# EAGLE design BUZZI-46 (EAGLE 5.01)
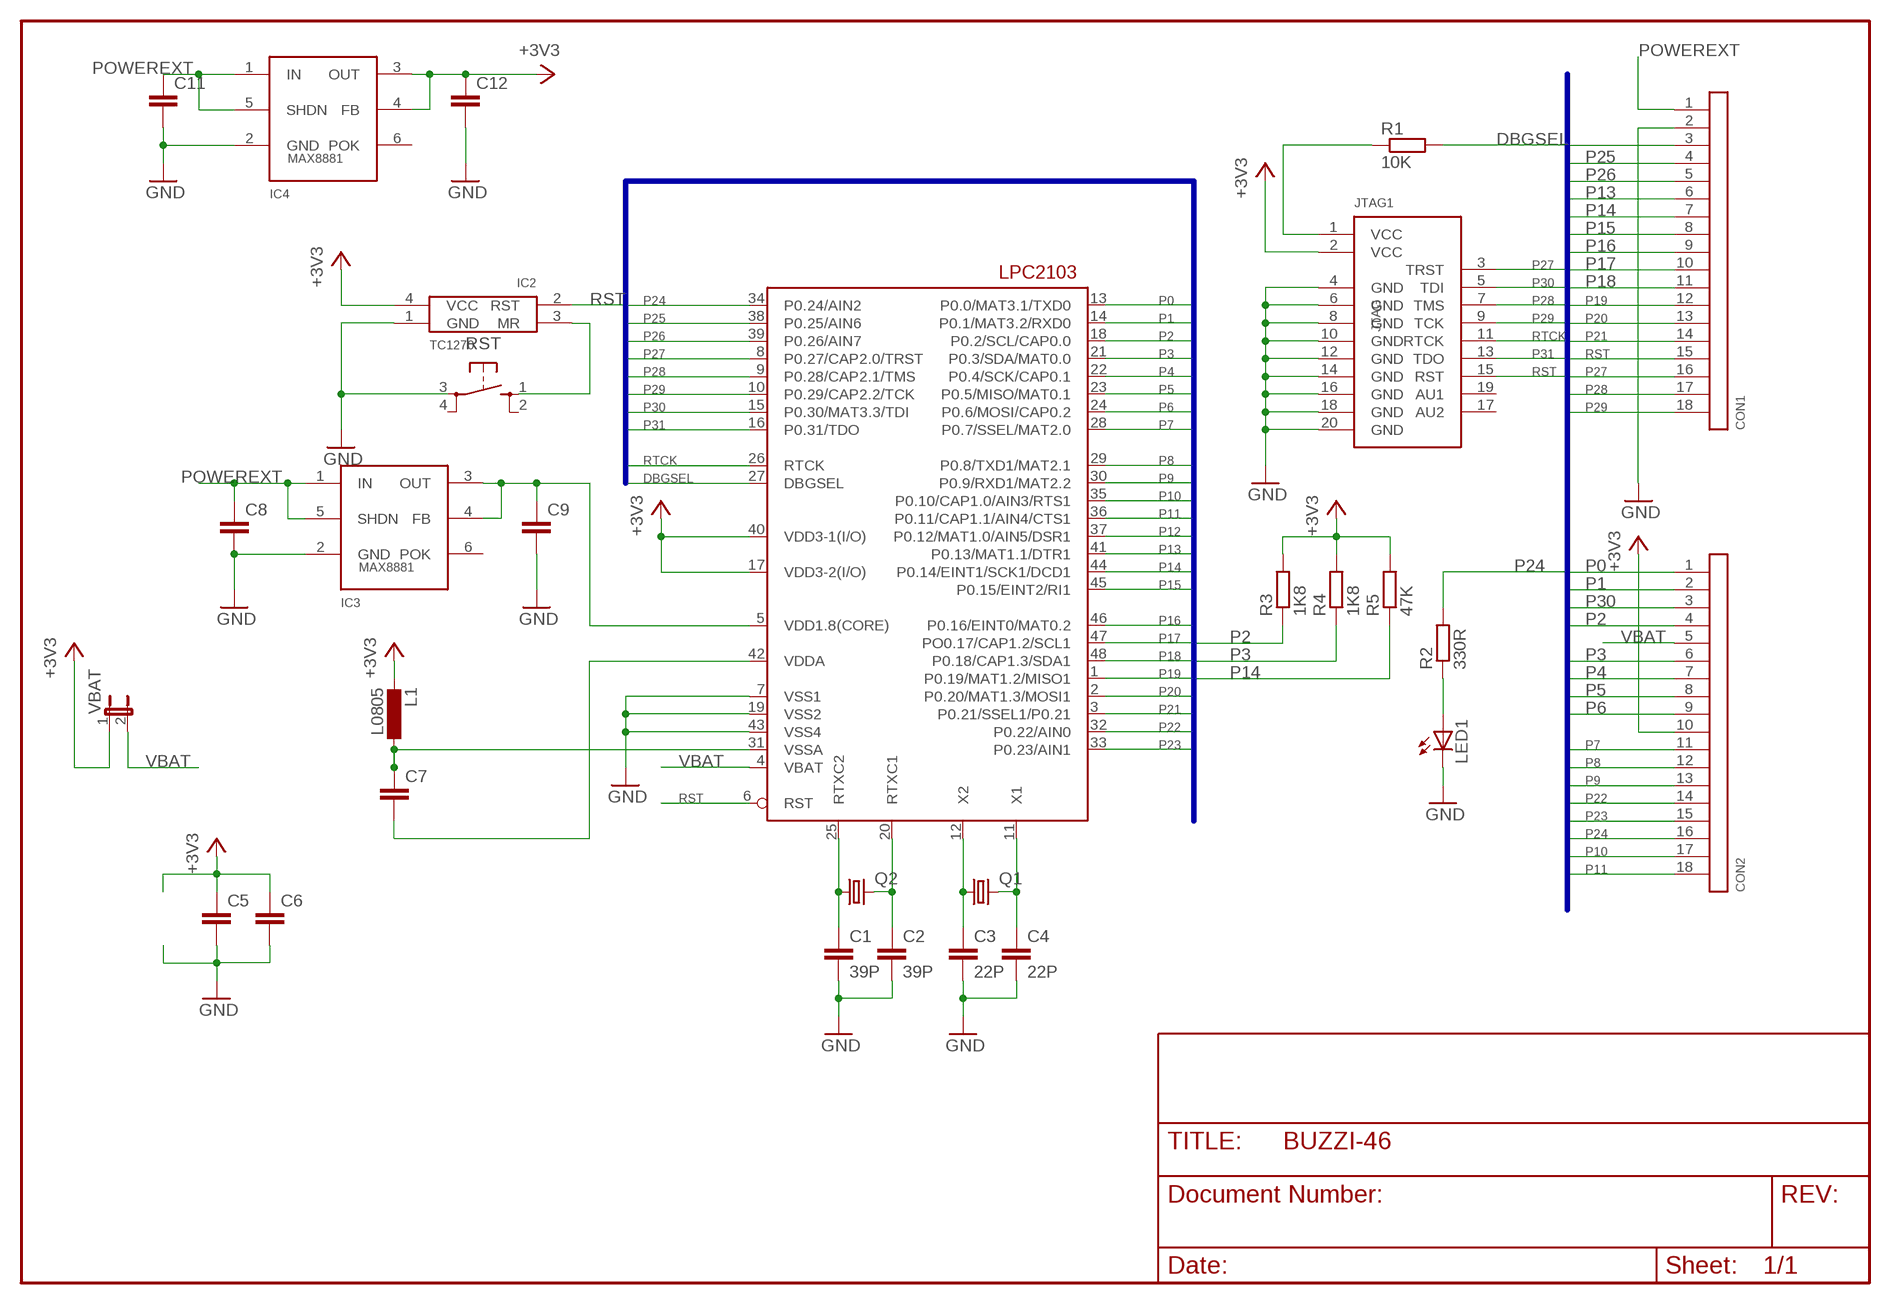
[diagram p0: schematic, sheet 1]

## Parts
C1  39P  C-EUC0603K  [C0603K]
C2  39P  C-EUC0603K  [C0603K]
C3  22P  C-EUC0603K  [C0603K]
C4  22P  C-EUC0603K  [C0603K]
C5  C-EUC0805  [C0805]
C6  C-EUC0805  [C0805]
C7  C-EUC0603  [C0603]
C8  C-EUC0805  [C0805]
C9  C-EUC0805  [C0805]
C11  C-EUC0805  [C0805]
C12  C-EUC0805  [C0805]
CON1  CON18  [MA18-1]
CON2  CON18  [MA18-1]
IC1  LPC2103  [LQFP48]
IC2  TC1270  [SOT143R_INFINEON]
IC3  MAX8881  [SOT23-6L]
IC4  MAX8881  [SOT23-6L]
JTAG1  ARM-JTAGMEDIUM-T  [CON-10-2-2.0-THROUGH]
L1  L0805  [C0805]
LED1  LEDCHIPLED_0805  [CHIPLED_0805]
Q1  CRYTALHC49S  [HC49/S]
Q2  CRYTALTC26V  [TC26V]
R1  10K  R-EU_M0805  [M0805]
R2  330R  R-EU_M0805  [M0805]
R3  1K8  R-EU_M0805  [M0805]
R4  1K8  R-EU_M0805  [M0805]
R5  47K  R-EU_M0805  [M0805]
RST  10XXSMD  [B3F-10XX-SMD]
VBAT  JP1E  [JP1]

## Nets
1V8: C9.1 IC1.5(VDD1.8(CORE)) IC3.3(OUT) IC3.4(FB)
+3V3: C5.1 C6.1 C12.1 CON2.10 IC1.17(VDD3-2(I/O)) IC1.40(VDD3-1(I/O)) IC2.4(VCC) IC4.3(OUT) IC4.4(FB) JTAG1.2(VCC) L1.2 R3.2 R4.2 R5.2 VBAT.1
DBGSEL: IC1.27(DBGSEL) R1.2
GND: C1.2 C2.2 C3.2 C4.2 C5.2 C6.2 C8.2 C9.2 C11.2 C12.2 CON1.2 IC1.7(VSS1) IC1.19(VSS2) IC1.43(VSS4) IC2.1(GND) IC3.2(GND) IC4.2(GND) JTAG1.4(GND) JTAG1.6(GND) JTAG1.8(GND) JTAG1.10(GND) JTAG1.12(GND) JTAG1.14(GND) JTAG1.16(GND) JTAG1.18(GND) JTAG1.20(GND) LED1.C RST.3
N$1: IC2.3(MR) RST.1
N$2: JTAG1.1(VCC) R1.1
N$3: LED1.A R2.1
N$6: C7.1 IC1.31(VSSA) L1.1
N$7: C7.2 IC1.42(VDDA)
P0: CON2.1 IC1.13(P0.0/MAT3.1/TXD0)
P1: CON2.2 IC1.14(P0.1/MAT3.2/RXD0)
P2: CON2.4 IC1.18(P0.2/SCL/CAP0.0) R3.1
P3: CON2.6 IC1.21(P0.3/SDA/MAT0.0) R4.1
P4: CON2.7 IC1.22(P0.4/SCK/CAP0.1)
P5: CON2.8 IC1.23(P0.5/MISO/MAT0.1)
P6: CON2.9 IC1.24(P0.6/MOSI/CAP0.2)
P7: CON2.11 IC1.28(P0.7/SSEL/MAT2.0)
P8: CON2.12 IC1.29(P0.8/TXD1/MAT2.1)
P9: CON2.13 IC1.30(P0.9/RXD1/MAT2.2)
P10: CON2.17 IC1.35(P0.10/CAP1.0/AIN3/RTS1)
P11: CON2.18 IC1.36(P0.11/CAP1.1/AIN4/CTS1)
P12: CON1.3 IC1.37(P0.12/MAT1.0/AIN5/DSR1)
P13: CON1.6 IC1.41(P0.13/MAT1.1/DTR1)
P14: CON1.7 IC1.44(P0.14/EINT1/SCK1/DCD1) R5.1
P15: CON1.8 IC1.45(P0.15/EINT2/RI1)
P16: CON1.9 IC1.46(P0.16/EINT0/MAT0.2)
P17: CON1.10 IC1.47(PO0.17/CAP1.2/SCL1)
P18: CON1.11 IC1.48(P0.18/CAP1.3/SDA1)
P19: CON1.12 IC1.1(P0.19/MAT1.2/MISO1)
P20: CON1.13 IC1.2(P0.20/MAT1.3/MOSI1)
P21: CON1.14 IC1.3(P0.21/SSEL1/P0.21)
P22: CON2.14 IC1.32(P0.22/AIN0)
P23: CON2.15 IC1.33(P0.23/AIN1)
P24: CON2.16 IC1.34(P0.24/AIN2) R2.2
P25: CON1.4 IC1.38(P0.25/AIN6)
P26: CON1.5 IC1.39(P0.26/AIN7)
P27: CON1.16 IC1.8(P0.27/CAP2.0/TRST) JTAG1.3(TRST)
P28: CON1.17 IC1.9(P0.28/CAP2.1/TMS) JTAG1.7(TMS)
P29: CON1.18 IC1.10(P0.29/CAP2.2/TCK) JTAG1.9(TCK)
P30: CON2.3 IC1.15(P0.30/MAT3.3/TDI) JTAG1.5(TDI)
P31: IC1.16(P0.31/TDO) JTAG1.13(TDO)
POWEREXT: C8.1 C11.1 CON1.1 IC3.1(IN) IC3.5(SHDN) IC4.1(IN) IC4.5(SHDN)
RST: CON1.15 IC1.6(RST) IC2.2(RST) JTAG1.15(RST)
RTCK: IC1.26(RTCK) JTAG1.11(RTCK)
RTXC1: C2.1 IC1.20(RTXC1) Q2.2
RTXC2: C1.1 IC1.25(RTXC2) Q2.1
VBAT: CON2.5 IC1.4(VBAT) VBAT.2
X1: C4.1 IC1.11(X1) Q1.2
X2: C3.1 IC1.12(X2) Q1.1
Unconnected: IC3.6(POK) IC4.6(POK) JTAG1.17(AU2) JTAG1.19(AU1) RST.2 RST.4

## Buses
P[0..31],RST,DBGSEL,RTCK

## Library data of the parts
C1-C9 C11 C12 = turbod3:C-EU: CAPACITOR, European symbol
CON1 CON2 = turbod3:CON18
IC1 = turbod3:LPC2103: LPC2101/2102/2103 microcontroler from Philips
IC2 = turbod3:TC1270
IC3 IC4 = turbod3:MAX8881
JTAG1 = turbod3:ARM-JTAG
L1 = turbod3:L
LED1 = led:LED: LED OSRAM: - CHIPLED LG R971, LG N971, LY N971, LG Q971, LY Q971, LO R971, LY R971 LH N974, LH R974 LS Q976, LO Q976, LY Q976 LO Q996 - Hyper CHIPLED LW Q18S LB Q993, LB Q99A, LB R99A - SideLED LS A670, LO A670, LY A670, LG A670, LP A670 LB A673, LV A673, LT A673, LW A673 LH A674 LY A675 LS A676, LA A676, LO A676, LY A676, LW A676 LS A679, LY A679, LG A679 - Hyper Micro SIDELED® LS Y876, LA Y876, LO Y876, LY Y876 LT Y87S - SmartLED LW L88C, LW L88S LB L89C, LB L89S, LG L890 LS L89K, LO L89K, LY L89K LS L896, LA L896, LO L896, LY L896 - TOPLED LS T670, LO T670, LY T670, LG T670, LP T670 LSG T670, LSP T670, LSY T670, LOP T670, LYG T670 LG T671, LOG T671, LSG T671 LB T673, LV T673, LT T673, LW T673 LH T674 LS T676, LA T676, LO T676, LY T676, LB T676, LH T676, LSB T676, LW T676 LB T67C, LV T67C, LT T67C, LS T67K, LO T67K, LY T67K, LW E67C LS E67B, LA E67B, LO E67B, LY E67B, LB E67C, LV E67C, LT E67C LW T67C LS T679, LY T679, LG T679 LS T770, LO T770, LY T770, LG T770, LP T770 LB T773, LV T773, LT T773, LW T773 LH T774 LS E675, LA E675, LY E675, LS T675 LS T776, LA T776, LO T776, LY T776, LB T776 LHGB T686 LT T68C, LB T68C - Hyper Mini TOPLED® LB M676 - Mini TOPLED Santana® LG M470 LS M47K, LO M47K, LY M47K Source: http://www.osram.convergy.de/
Q1 Q2 = turbod3:CRYTAL: CRYSTAL
R1-R5 = turbod3:R-EU_: RESISTOR, European symbol
RST = turbod3:10XX
VBAT = jumper:JP1E: JUMPER

## Board
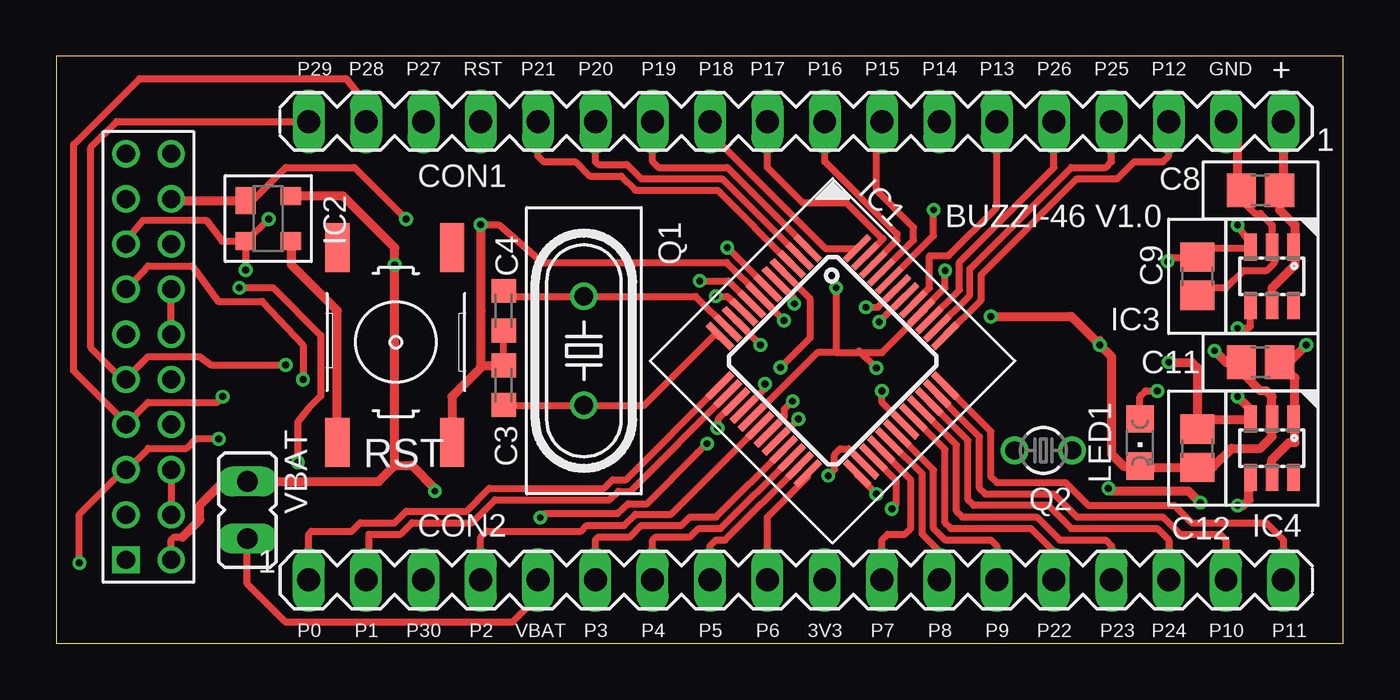
[diagram p1: board, top side]
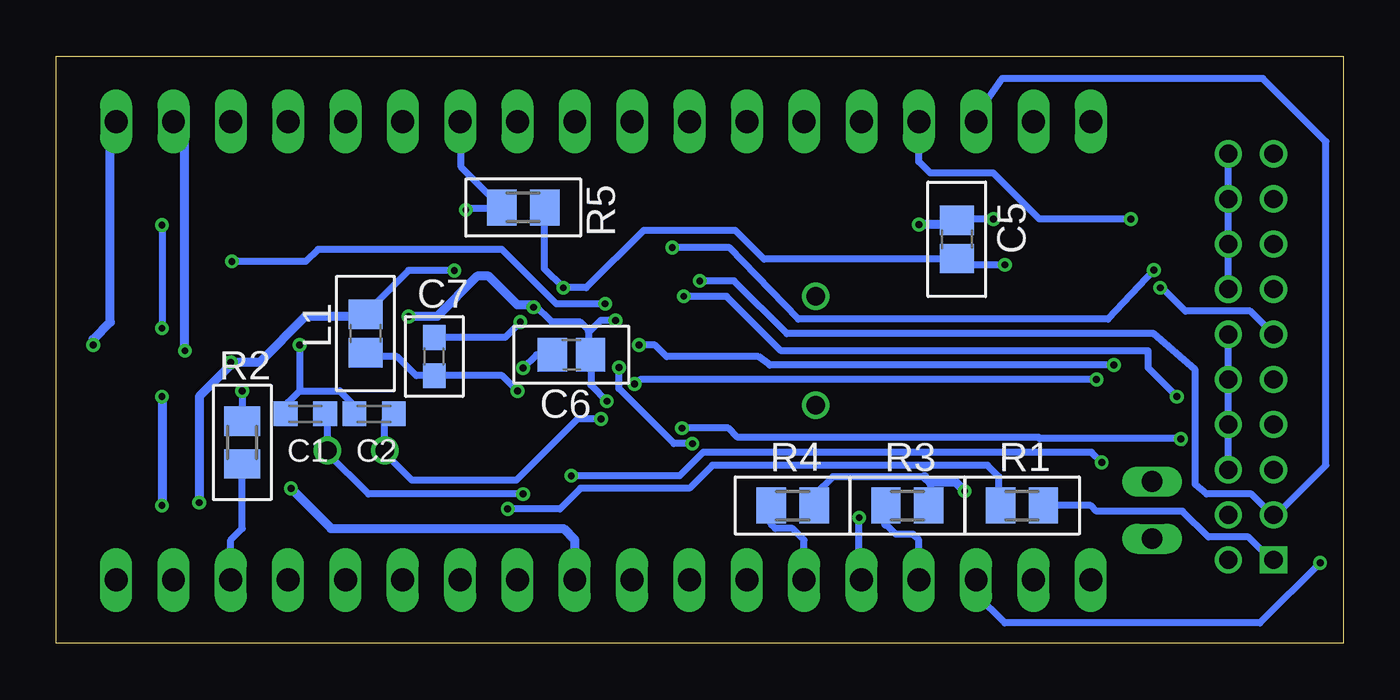
[diagram p2: board, bottom side, seen from below]

Size 57 x 26 mm. Coordinates in mm from the lower left corner, seen from the top.
Outline: 0,0 57,0 57,26 0,26 0,0
Copper layers (1*16): Top 0.035mm / dielectric 1.5mm / Bottom 0.035mm
Design rules "PCB-POOL": minimum track width 6mil, minimum drill 12mil, track to track 6mil, track to pad 6mil, pad to pad 6mil, via to via 6mil, smd to smd 6mil, copper to edge 20mil, drill to drill 8mil, minimum pad ring 8mil, minimum via ring 6mil, stop-mask expansion 3mil, vias tented up to drill 0mil, thermal gap 8mil

### Footprints (pad centres in the part's own frame; a part is rotated, then mirrored left to right if it is on the bottom)
C0603K = smd 1.05 x 1.08: 1 -0.875,0; 2 0.875,0
C0805 = smd 1.3 x 1.5: 1 -0.85,0; 2 0.85,0
C0603 = smd 1.1 x 1: 1 -0.85,0; 2 0.85,0
MA18-1 = drill 1.016 long: 1 -24.13,0; 2 -21.59,0; 3 -19.05,0; 4 -16.51,0; 5 -13.97,0; 6 -11.43,0; 7 -8.89,0; 8 -6.35,0; 9 -3.81,0; 10 -1.27,0; 11 1.27,0; 12 3.81,0; 13 6.35,0; 14 8.89,0; 15 11.43,0; 16 13.97,0; 17 16.51,0; 18 19.05,0
LQFP48 = smd 1.5 x 0.3: 1 -4.3,2.75; 2 -4.3,2.25; 3 -4.3,1.75; 4 -4.3,1.25; 5 -4.3,0.75; 6 -4.3,0.25; 7 -4.3,-0.25; 8 -4.3,-0.75; 9 -4.3,-1.25; 10 -4.3,-1.75; 11 -4.3,-2.25; 12 -4.3,-2.75; 25 4.3,-2.75; 26 4.3,-2.25; 27 4.3,-1.75; 28 4.3,-1.25; 29 4.3,-0.75; 30 4.3,-0.25; 31 4.3,0.25; 32 4.3,0.75; 33 4.3,1.25; 34 4.3,1.75; 35 4.3,2.25; 36 4.3,2.75 | smd 0.3 x 1.5: 13 -2.75,-4.3; 14 -2.25,-4.3; 15 -1.75,-4.3; 16 -1.25,-4.3; 17 -0.75,-4.3; 18 -0.25,-4.3; 19 0.25,-4.3; 20 0.75,-4.3; 21 1.25,-4.3; 22 1.75,-4.3; 23 2.25,-4.3; 24 2.75,-4.3; 37 2.75,4.3; 38 2.25,4.3; 39 1.75,4.3; 40 1.25,4.3; 41 0.75,4.3; 42 0.25,4.3; 43 -0.25,4.3; 44 -0.75,4.3; 45 -1.25,4.3; 46 -1.75,4.3; 47 -2.25,4.3; 48 -2.75,4.3
SOT143R_INFINEON = smd 1.2 x 0.9: 1 -0.8,-1 | smd 0.8 x 0.9: 2 1,-1; 3 1,1; 4 -1,1
SOT23-6L = smd 0.55 x 1.2: 1 -0.95,-1.3; 2 0,-1.3; 3 0.95,-1.3; 4 0.95,1.3; 5 0,1.3; 6 -0.95,1.3
CON-10-2-2.0-THROUGH = drill 0.8 square: 1 -8,2 | drill 0.8 round: 2 -8,0; 3 -6,2; 4 -6,0; 5 -4,2; 6 -4,0; 7 -2,2; 8 -2,0; 9 0,2; 10 0,0; 11 2,2; 12 2,0; 13 4,2; 14 4,0; 15 6,2; 16 6,0; 17 8,2; 18 8,0; 19 10,2; 20 10,0
CHIPLED_0805 = smd 1.2 x 1.2: A 0,-1.05; C 0,1.05
HC49/S = drill 0.813 round: 1 -2.413,0; 2 2.413,0
TC26V = drill 0.813 round: 1 -1.27,0; 2 1.27,0
M0805 = smd 1.3 x 1.6: 1 -0.95,0; 2 0.95,0
B3F-10XX-SMD = smd 2.184 x 1.067: 1 -4.572,2.54; 2 4.064,2.54; 3 -4.572,-2.54; 4 4.064,-2.54
JP1 = drill 0.914 long: 1 0,-1.27; 2 0,1.27

### Placement (x,y rotation side)
C1  45.97,10.16 180 bottom
C2  42.93,10.16 180 bottom
C3  19.81,11.43 90 top
C4  19.81,14.73 270 top
C5  17.11,17.89 90 bottom
C6  34.19,12.78 0 bottom
C7  40.26,12.7 90 bottom
C8  53.34,20.07 180 top
C9  50.55,16.26 270 top
C11  53.34,12.45 180 top
C12  50.55,8.64 270 top
CON1  30.23,23.11 180 top
CON2  35.31,2.79 0 top
IC1  34.38,12.51 315 top
IC2  9.38,18.81 270 top
IC3  53.85,16.26 180 top
IC4  53.85,8.64 180 top
JTAG1  5.08,11.68 90 top
L1  43.31,13.72 90 bottom
LED1  48.01,8.89 180 top
Q1  23.37,12.95 90 top
Q2  43.72,8.54 180 top
R1  14.22,6.1 180 bottom
R2  48.77,8.89 270 bottom
R3  19.3,6.1 0 bottom
R4  24.38,6.1 0 bottom
R5  36.32,19.3 0 bottom
RST  14.99,13.46 90 top
VBAT  8.46,5.89 180 top

### Tracks (layer width: path | path; a pad name or v marks a point on that pad's centre or on a via)
1V8  (via drill 0.3)
  Top 0.305: 50.55,17.09 50.55,17.51 52.87,17.51 IC3.3 52.93,17.67 v52.32,18.53 | 53.02,15.03 IC3.4 52.9,14.04 52.83,13.97 52.32,13.97 v52.32,13.95 | IC1.5 32.69,15.26 v32.69,15.04 | 50.55,17.09 C9.1 | v49.23,16.92 49.4,17.09 50.55,17.09
  Bottom 0.305: v52.32,18.53 v52.32,13.95 | v32.69,15.04 34.85,15.04 37.26,17.45 45.41,17.45 45.95,16.92 v49.23,16.92
+3V3  (via drill 0.3)
  Top 0.305: IC1.17 30.83,10 33.71,12.88 34.54,12.88 | 38.36,14.66 38.46,14.76 | 38.36,14.66 IC1.40 38.31,14.68 39.37,15.75 v39.37,16.51 | 34.54,12.88 35.56,12.88 | 35.56,12.88 36.58,12.88 38.36,14.66 | v34.54,15.75 34.54,12.88 | 14.48,7.37 14.43,7.32 | 10.92,19.81 10.67,19.81 IC2.4 | 35.56,12.88 35.56,12.95 v36.32,12.19 | 7.92,7.16 VBAT.1 8.76,7.11 7.37,7.11 | JTAG1.2 5.08,4.57 5.21,4.7 5.59,4.7 | 16.76,6.86 v16.76,6.73
  Top 0.406: 14.99,7.87 14.48,7.37 14.28,7.16 VBAT.1 | 14.99,7.87 v14.99,16.76 14.99,17.53 12.7,19.81 10.67,19.81 | v52.32,10.92 52.9,10.35 IC4.3 52.85,9.92 52.83,9.91 51.05,9.91 50.65,9.5 C12.1 50.55,12.19 50.29,12.45 v49.28,12.45 | v52.32,6.1 52.58,6.1 52.83,6.35 52.83,7.11 52.9,7.18 IC4.4 | 5.59,4.7 6.35,5.46 6.35,6.1 7.37,7.11 | 16.76,6.86 15.75,7.87 14.99,7.87 | v46.61,6.86 46.74,6.73 50.16,6.73 v50.67,6.22
  Bottom 0.305: L1.2 43.31,14.61 41.4,16.51 v39.37,16.51 | 17.27,17.02 17.25,17.04 C5.1 | v14.99,16.76 17.02,16.76 17.27,17.02 | 17.27,17.02 25.65,17.02 26.92,18.29 30.99,18.29 33.53,15.75 v34.54,15.75 35.38,16.59 35.38,19.31 | 35.38,19.31 35.38,19.33 | 35.38,19.31 R5.2 | C6.1 35.74,12.78 v36.32,12.19 | R4.2 23.43,6.54 22.61,7.37 18.54,7.37 | R3.2 18.29,6.35 18.29,7.11
  Bottom 0.406: v52.32,10.92 v52.32,6.1 | L1.2 43.27,14.57 43.18,14.48 45.97,14.48 48.01,12.45 v49.28,12.45 49.28,12.32 50.67,10.92 v50.67,6.22 | CON2.10 34.04,4.57 34.54,5.08 44.83,5.08 v46.61,6.86 | 18.54,7.37 18.29,7.11 17.14,7.11 v16.76,6.73
DBGSEL  (via drill 0.3)
  Top 0.305: IC1.27 36.16,8.24 37.21,7.19 37.21,6.15 v37.01,5.94
  Bottom 0.305: v37.01,5.94 34.7,5.94 33.78,6.86 28.96,6.86 27.94,7.87 15.75,7.87 15.24,7.37 15.24,6.35 R1.2 15.17,6.54 15.24,6.6
GND  (via drill 0.3)
  Top 0.305: C9.2 50.67,15.61 50.55,15.73 51.82,15.73 52.58,16.49 53.59,16.49 53.98,16.88 IC3.2 53.95,17.67 53.85,17.76 53.85,18.53 53.34,19.03 53.09,19.03 52.62,19.5 C8.2 | C3.2 C4.2 | JTAG1.12 5.17,13.68 5.18,13.69 5.08,13.79 JTAG1.14 | 5.08,5.64 JTAG1.4 | JTAG1.6 5.08,5.64 | 5.08,5.64 5.11,5.61 | IC2.1 8.69,19.61 10.16,21.08 13.21,21.08 v15.49,18.8 | v18.8,18.54 19.58,18.54 21.51,16.87 29.69,16.87 31.16,15.39 IC1.7 v32.23,14.3 | IC1.19 31.54,9.29 32.23,10.01 32.23,10.36 v32.61,10.72 | IC1.43 36.41,14.88 v35.87,14.88 | 52.59,11.92 52.59,12.43 | v46.23,13.21 46.23,13.46 45.97,13.46
  Top 0.406: C8.2 52.56,20.05 52.58,20.07 52.32,20.32 52.32,22.61 CON1.2 | JTAG1.18 5.08,19.56 5.13,19.61 IC2.1 | RST.3 17.53,10.92 18.8,12.19 18.8,12.27 | 19.81,12.19 C3.2 18.81,12.3 18.77,12.27 18.8,12.27 | C4.2 19.67,13.86 | v18.8,18.54 18.8,14.76 | 18.8,14.76 18.8,14.73 | v51.31,12.95 51.83,12.43 C11.2 52.59,12.43 | 53.85,9.91 53.85,9.65 | 53.85,9.91 IC4.2 | 53.85,9.91 53.85,9.14 53.34,8.64 52.07,8.64 51.24,7.8 C12.2 48.09,7.79 48.01,7.87 LED1.C 47.28,7.84 46.74,8.38 46.74,12.7 v46.23,13.21 45.97,13.46 44.96,14.48 v41.4,14.48 | 52.59,11.92 53.34,11.18 53.59,11.18 53.85,10.92 53.85,9.91 | 18.8,14.76 18.82,14.76 18.8,14.73 | 18.8,14.73 18.8,12.27
  Bottom 0.305: C2.2 43.8,10.53 44.45,11.18 46.23,11.18 | 46.23,11.18 46.74,10.67 46.74,10.16 C1.2 | JTAG1.20 5.08,19.79 5.16,19.71 5.13,19.68 JTAG1.18 JTAG1.16 | JTAG1.16 5.08,17.53 | 5.17,15.68 5.21,15.65 | JTAG1.14 5.17,15.68 | JTAG1.16 5.08,15.77 5.17,15.68 | JTAG1.10 5.08,11.56 | JTAG1.10 JTAG1.12 | JTAG1.8 5.08,9.63 5.11,9.6 | JTAG1.8 JTAG1.10 | 5.09,7.68 5.11,7.67 | JTAG1.6 5.09,7.68 | JTAG1.8 5.08,7.7 5.09,7.68 | C5.2 17.22,18.74 17.27,18.8 v15.49,18.8 | v32.23,14.3 32.89,14.3 33.43,13.77 | 33.43,13.77 33.43,12.72 33.38,12.68 33.34,12.71 C6.2 33.33,12.76 33.33,11.43 v32.61,10.72 | v46.23,13.21 46.23,11.18 | 33.43,13.77 33.43,13.87 33.78,14.22 35.05,14.22 35.81,14.99
  Bottom 0.406: 17.07,18.74 17.02,18.8 | C5.2 17.07,18.74 | v18.8,18.54 17.27,18.54 17.07,18.74 | v51.31,12.95 51.31,22.61 CON1.2 | v41.4,14.48 40.13,14.48 38.35,16.26 37.85,16.26 36.58,14.99 35.81,14.99 35.87,14.94 v35.87,14.88
N$1
  Top 0.406: RST.1 12.45,14.73 10.41,16.76 10.41,17.78 IC2.3
N$2
  Bottom 0.305: R1.1 11.18,6.1 10.92,5.84 7.11,5.84 5.97,4.7 4.19,4.7 3.18,3.68 JTAG1.1
N$3  (via drill 0.3)
  Top 0.305: v48.77,11.18 48.26,11.18 48.01,10.92 LED1.A
  Bottom 0.305: 48.45,9.84 R2.1 v48.77,11.18
N$6  (via drill 0.3)
  Top 0.305: IC1.31 37.85,9.4 | IC1.31 | v36.58,11.18 36.58,10.67 IC1.31
  Bottom 0.305: C7.1 40.22,11.85 40.13,11.94 | C7.1 37.25,11.85 v36.58,11.18 | C7.1 41.06,11.85 41.91,12.7 43.43,12.7
  Bottom 0.406: 43.43,12.7 43.31,12.83 L1.1
N$7  (via drill 0.3)
  Top 0.305: IC1.42 v36.45,14.22
  Bottom 0.305: v36.45,14.22 37.12,13.55 C7.2 40.26,13.59 40.3,13.55
P0
  Top 0.305: IC1.13 25.22,7.24 24.64,7.24 24.26,6.86 19.18,6.86 18.16,5.84 15.49,5.84 14.99,5.33 13.46,5.33 13.08,4.95 11.3,4.95 11.18,4.83 CON2.1
P1
  Top 0.305: IC1.14 25.42,6.73 24.89,6.73 24.51,6.35 19.43,6.35 18.41,5.33 15.75,5.33 15.24,4.83 13.84,4.83 13.84,2.92 CON2.2
P2
  Top 0.305: IC1.18 27.23,5.71 25.65,5.71 25.15,5.21 23.5,5.21 23.24,4.95 19.05,4.95 18.8,4.7 CON2.4
  Bottom 0.305: 20.25,5.27 19.81,4.83 19.05,4.83 18.8,4.57 CON2.4
  Bottom 0.406: 20.25,5.27 R3.1
P3
  Top 0.305: IC1.21 29.23,5.59 28.07,5.59 27.69,5.21 25.91,5.21 25.4,4.7 24,4.7 23.88,4.57 CON2.6
  Bottom 0.305: R4.1 25.33,5.27 25.15,5.08 24.38,5.08 23.88,4.57 CON2.6
P4
  Top 0.305: IC1.22 29.43,5.08 28.45,5.08 28.07,4.7 26.54,4.7 26.42,4.57 CON2.7
P5
  Top 0.305: IC1.23 29.63,4.57 29.21,4.57 28.96,4.32 CON2.8 28.96,2.54
P6
  Top 0.305: IC1.24 33.29,7.38 31.5,5.59 CON2.9
P7
  Top 0.305: IC1.28 36.54,8.55 37.85,7.24 37.85,5.08 37.59,4.83 36.83,4.83 36.58,4.57 CON2.11
P8
  Top 0.305: IC1.29 37.02,8.83 38.35,7.49 38.35,4.83 39.12,4.06 CON2.12
P9
  Top 0.305: IC1.30 38.86,7.67 38.86,5.08 39.37,4.57 41.4,4.57 41.66,4.32 CON2.13
P10
  Top 0.305: IC1.35 39.01,11.02 40.89,9.14 40.89,6.86 41.15,6.6 44.2,6.6 45.21,5.59 49.02,5.59 49.78,4.83 51.56,4.83 51.82,4.57 CON2.17 51.82,2.54
P11
  Top 0.305: IC1.36 41.4,9.38 41.4,7.37 41.66,7.11 44.7,7.11 45.72,6.1 49.53,6.1 50.29,5.33 53.59,5.33 54.36,4.57 CON2.18
P12
  Top 0.305: IC1.37 40.97,15.21 40.97,16.33 45.21,20.57 46.99,20.57 47.75,21.34 49.02,21.34 49.28,21.59 CON1.3
P13
  Top 0.305: IC1.41 38.68,15.75 38.68,17.17 39.52,17.17 41.66,19.3 CON1.6
P14  (via drill 0.3)
  Top 0.305: IC1.44 38.86,18.05 v38.86,19.2
  Bottom 0.305: v38.86,19.2 38.79,19.28 37.29,19.28 37.29,19.29 R5.1 39.06,21.1 39.06,23.06 CON1.7
P15
  Top 0.305: IC1.45 37.97,17.86 37.97,18.41 36.32,20.07 36.32,22.86 CON1.8
P16
  Top 0.305: IC1.46 36.19,16.8 37.24,17.86 37.24,18.14 34.04,21.34 CON1.9
P17
  Top 0.305: IC1.47 36.63,17.93 36.58,17.93 35,19.51 33.07,19.51 31.5,21.08 CON1.10
P18
  Top 0.305: IC1.48 34.07,17.49 28.96,22.61
  Top 0.406: 28.96,22.61 CON1.11
P19
  Top 0.305: IC1.1 33.29,17.51 29.72,21.08 26.67,21.08 26.42,21.34 CON1.12
P20
  Top 0.305: IC1.2 33.03,17.04 29.49,20.57 25.91,20.57 25.27,21.21 24,21.21 23.88,21.34 CON1.13
P21
  Top 0.305: IC1.3 32.53,16.82 29.29,20.07 25.65,20.07 25.02,20.7 23.62,20.7 22.99,21.34 21.59,21.34 21.34,21.59 CON1.14
P22
  Top 0.305: IC1.32 39.37,8.58 39.37,5.33 39.62,5.08 43.18,5.08 44.2,4.06 CON2.14
P23
  Top 0.305: IC1.33 39.88,8.78 39.88,5.84 40.13,5.59 43.43,5.59 44.45,4.57 46.48,4.57 46.74,4.32 CON2.15
P24
  Top 0.305: IC1.34 40.39,8.98 40.39,6.35 40.64,6.1 43.94,6.1 44.96,5.08 48.77,5.08 49.28,4.57 CON2.16
  Bottom 0.305: R2.2 48.77,5.08 49.28,4.57 CON2.16
P25
  Top 0.305: IC1.38 40.46,15.41 40.46,16.59 44.96,21.08 46.48,21.08 46.74,21.34 CON1.4
P26
  Top 0.305: IC1.39 40.01,15.66 40.01,16.89 44.2,21.08 CON1.5
P27  (via drill 0.3)
  Top 0.305: IC1.8 | IC1.8 30.89,14.94 | v28.5,16.05 29.77,16.05 IC1.8
  Bottom 0.305: v28.5,16.05 26.98,16.05 24.64,13.72 8.38,13.72 6.55,12.12 6.55,7.04 6.04,6.6 4.06,6.6 3.08,5.62 | CON1.16 16.26,23.37 15.11,25.02 3.56,25.02 0.76,22.23 0.76,7.87 3.05,5.59 3.08,5.62 | JTAG1.3 3.08,5.62
P28  (via drill 0.3)
  Top 0.305: IC1.9 30.45,14.66 29.98,15.13 | 29.98,15.13 29.82,15.29 | JTAG1.7 3.05,9.65 | JTAG1.7 4.06,10.67 7.14,10.67 v7.37,10.92 | 29.98,15.13 29.97,15.11 29.72,15.37 v29.21,15.37 | CON1.17 13.72,23.88 12.83,25.02 3.68,25.02 0.76,22.1 0.76,12.06 3.14,9.68 | 3.14,9.68 3.3,9.53 | JTAG1.7 3.14,9.68
  Bottom 0.305: v29.21,15.37 27.3,15.37 24.89,12.95 8.64,12.95 8.64,12.19 v7.37,10.92
P29  (via drill 0.3)
  Top 0.305: IC1.10 30.1,14.29 v31.19,13.21 | v10.16,12.32 6.86,12.32 6.35,12.7 4.06,12.7 3.08,11.72 JTAG1.9 3.08,11.59 3.05,11.56 1.52,13.08 1.52,21.97 2.67,23.11 CON1.18
  Bottom 0.305: v10.16,12.32 25.4,12.32 25.91,12.7 29.97,12.7 30.48,13.21 v31.19,13.21
P30  (via drill 0.3)
  Top 0.305: IC1.15 30.09,10.71 29.34,9.96 v29.29,9.53 | v7.19,9.04 7.16,9.07 6.2,9.07 5.77,8.64 4.06,8.64 4.06,8.61 3.12,7.67 3.11,7.68 JTAG1.5 3.08,7.71 3.05,7.75 1.02,5.71 v1.02,3.56
  Bottom 0.305: v29.29,9.53 27.23,9.53 26.82,9.12 13.49,9.12 13.44,9.07 7.29,9.07 7.19,8.97 | 7.19,8.97 7.11,8.89 | v7.19,9.04 7.19,8.97 | CON2.3 16.26,2.16 14.99,0.89 3.68,0.89 v1.02,3.56
P31  (via drill 0.3)
  Top 0.305: IC1.16 30.46,10.37 31.06,10.95 31.39,11.28 v31.39,11.48 | v10.92,11.68 10.92,13.21 9.12,15.14 7.16,15.14 6.02,16.71 4.06,16.71 3.08,15.64 JTAG1.13
  Bottom 0.305: v31.39,11.48 31.39,11.46 31.37,11.43 31.11,11.68 v10.92,11.68
POWEREXT  (via drill 0.3)
  Top 0.406: C8.1 54.19,19.2 54.86,18.53 | 54.86,18.53 54.86,17.76 | 54.86,17.76 54.86,17.51 54.83,17.54 IC3.1 54.8,17.7 54.86,17.76 | IC3.5 53.85,15.73 54.86,16.75 54.86,17.76 | 54.86,9.85 IC4.1 | 54.86,9.85 54.86,11.76 C11.1 54.59,12.43 v55.37,13.21 | C8.1 54.34,20.05 | C8.1 54.36,20.22 CON1.1 | 54.86,18.53 54.86,18.54 | 54.86,9.85 54.86,8.89 54.61,8.89 53.85,8.13 IC4.5
  Bottom 0.406: v55.37,13.21 55.37,13.46 54.61,14.22 54.61,22.35 54.36,22.61 CON1.1
RST  (via drill 0.3)
  Top 0.305: IC1.6 v29.72,17.53 | IC2.2 v8.38,16.54 | IC2.2 7.33,17.81 6.63,18.75 3.83,18.75 3.05,17.78 3.08,17.75 JTAG1.15 | IC2.2 8.41,17.81 v9.4,18.8
  Bottom 0.305: v29.72,17.53 27.18,17.53 24.13,14.35 10.41,14.35 v8.38,16.54 | CON1.15 18.8,21.34 18.29,20.83 15.49,20.83 13.46,18.8 v9.4,18.8
RTCK  (via drill 0.3)
  Top 0.305: IC1.26 35.1,8.61 34.72,8.61 34.47,8.36 34.47,7.7 v34.19,7.42 | v10.69,8 10.69,9.8 11.18,10.41 11.71,10.95 11.71,13.64 9.6,15.75 v8.1,15.75
  Bottom 0.305: v34.19,7.42 29.39,7.42 28.35,8.46 11.15,8.46 v10.69,8 | v8.1,15.75 8.03,15.75 6.99,14.71 4.12,14.71 JTAG1.11 | JTAG1.11 3.07,13.66 | JTAG1.11
RTXC1  (via drill 0.3)
  Top 0.305: IC1.20 v32.87,9.93
  Bottom 0.305: v32.87,9.93 33.91,9.93 36.63,7.21 41.25,7.21 42.57,8.54 | 42.57,8.54 42.67,8.64 | 42.57,8.54 Q2.2 42.45,9.87 42.16,10.16 C2.1
RTXC2  (via drill 0.3)
  Top 0.305: IC1.25 35.48,7.45 v36.32,6.6
  Bottom 0.305: v36.32,6.6 43.18,6.6 44.99,8.41 Q2.1 44.99,10.13 44.97,10.15 | 44.97,10.15 44.96,10.16 | 44.97,10.15 C1.1
VBAT  (via drill 0.3)
  Top 0.305: IC1.4 32.23,16.42 33.4,15.24 33.4,13.54 v32.08,12.22 | v28.83,8.84 28.4,8.43 26.16,6.17 25.32,6.17 24.87,5.74 21.61,5.74 v21.44,5.56 | VBAT.2 8.46,2.62 10.13,0.94 20.22,0.94 21.31,2.03 21.31,2.72 21.39,2.79 | 21.39,2.79 21.41,2.82 | 21.39,2.79 CON2.5
  Bottom 0.305: v32.08,12.22 32.08,11.28 29.64,8.84 v28.83,8.84 | CON2.5 21.31,2.79 21.26,2.85 21.44,3.02 v21.44,5.56
X1
  Top 0.305: 29.75,13.94 29.97,13.72 | 29.75,13.94 IC1.11 | 29.75,13.94 28.32,15.37 Q1.2 20.19,15.37 19.81,15.75 C4.1
X2
  Top 0.305: IC1.12 29.32,13.6 29.21,13.72 26.04,10.54 Q1.1 19.94,10.54 19.81,10.67 C3.1

### Text on the board
tNames: P29 | P28 | P27 | RST | P21 | P20 | P19 | P18 | P17 | P16 | P15 | P14 | P13 | P26 | P25 | P12 | GND | + | BUZZI-46 V1.0 | P0 | P1 | P30 | P2 | VBAT | P3 | P4 | P5 | P6 | 3V3 | P7 | P8 | P9 | P22 | P23 | P24 | P10 | P11